# Altium schematic sheet connectors.SchDoc: Triumvi - MCU - Connectors
size Letter; Author: Ye-Sheng Kuo; Revision: 9; SheetNumber: 5; SheetTotal: 5
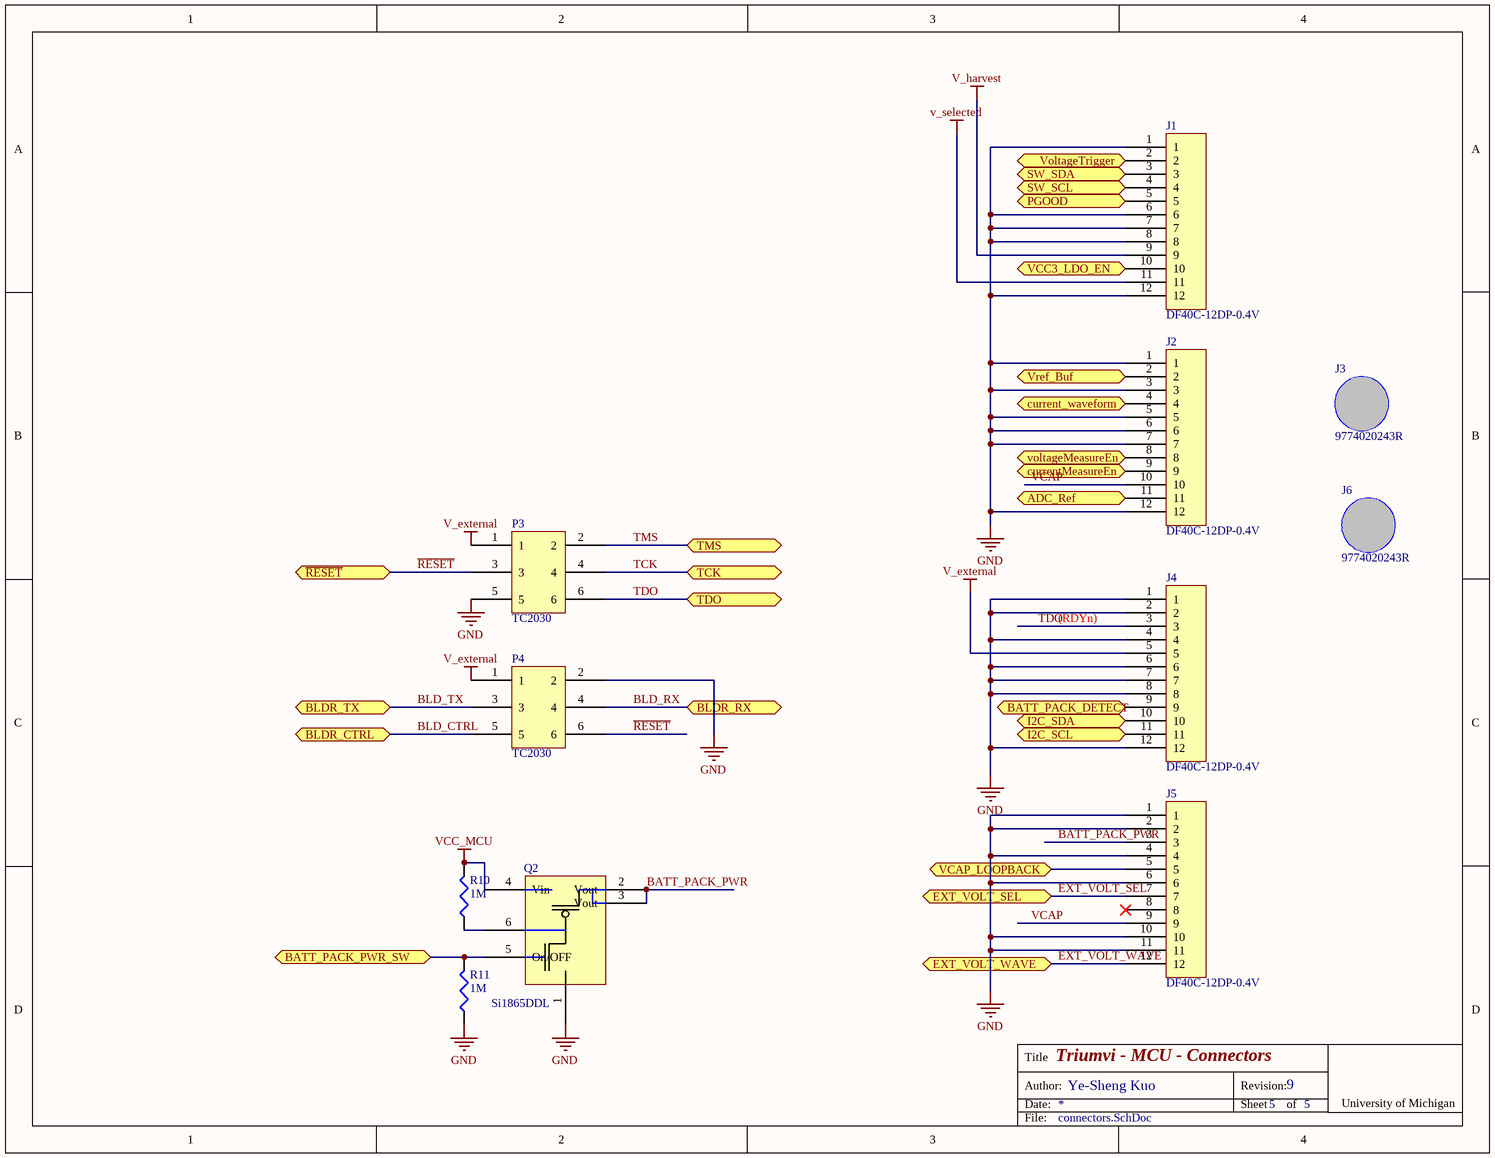
[diagram p0: connectors.SchDoc]

## Parts
J1  DF40C-12DP-0.4V  [DF40C-12DP-0.4V]
J2  DF40C-12DP-0.4V  [DF40C-12DP-0.4V]
J3  9774020243R  [9774020243R]
J4  DF40C-12DP-0.4V  [DF40C-12DP-0.4V]
J5  DF40C-12DP-0.4V  [DF40C-12DP-0.4V]
J6  9774020243R  [9774020243R]
P3  TC2030  [TC2030-IDC-NLFP]
P4  TC2030  [TC2030-IDC-NLFP]
Q2  Si1865DDL  [SC70-6]
R10  value 1M  [0402]  (hidden comment: Chip resistor)
R11  value 1M  [0402]  (hidden comment: Chip resistor)

## Ports
ADC_Ref, BATT_PACK_DETECT, BATT_PACK_PWR_SW, BLDR_CTRL, BLDR_RX, BLDR_TX, current_waveform, currentMeasureEn, EXT_VOLT_SEL, EXT_VOLT_WAVE, I2C_SCL, I2C_SDA, PGOOD, SW_SCL, SW_SDA, TCK, TDO, TMS, VCAP_LOOPBACK, VCC3_LDO_EN, voltageMeasureEn, VoltageTrigger, Vref_Buf, ~{RESET}

## Nets
GND: J1.1 J1.6 J1.7 J1.8 J1.12 J2.1 J2.3 J2.5 J2.6 J2.7 J2.12 J4.1 J4.2 J4.4 J4.6 J4.7 J4.8 J4.12 J5.1 J5.2 J5.4 J5.6 J5.10 J5.11 P3.5 P4.2 Q2.1(S1) R11.2
V_external: J4.5 P3.1 P4.1
V_harvest: J1.9
v_selected: J1.11
VCC_MCU: Q2.4(Vin) R10.1
ADC_Ref: J2.11 ; port ADC_Ref
BATT_PACK_DETECT: J4.9 ; port BATT_PACK_DETECT
BATT_PACK_PWR: J5.3 Q2.2(Vout) Q2.3(Vout)
BATT_PACK_PWR_SW: Q2.5(On/OFF) R11.1 ; port BATT_PACK_PWR_SW
BLD_CTRL: P4.5 ; port BLDR_CTRL
BLD_RX: P4.4 ; port BLDR_RX
BLD_TX: P4.3 ; port BLDR_TX
current_waveform: J2.4 ; port current_waveform
currentMeasureEn: J2.9 ; port currentMeasureEn
EXT_VOLT_SEL: J5.7 ; port EXT_VOLT_SEL
EXT_VOLT_WAVE: J5.12 ; port EXT_VOLT_WAVE
I2C_SCL: J4.11 ; port I2C_SCL
I2C_SDA: J4.10 ; port I2C_SDA
PGOOD: J1.5 ; port PGOOD
~{RESET}: P3.3 P4.6 ; port ~{RESET}
SW_SCL: J1.4 ; port SW_SCL
SW_SDA: J1.3 ; port SW_SDA
TCK: P3.4 ; port TCK
TDO: J4.3 P3.6 ; port TDO
TMS: P3.2 ; port TMS
VCAP: J2.10 J5.9
VCAP_LOOPBACK: J5.5 ; port VCAP_LOOPBACK
VCC3_LDO_EN: J1.10 ; port VCC3_LDO_EN
voltageMeasureEn: J2.8 ; port voltageMeasureEn
VoltageTrigger: J1.2 ; port VoltageTrigger
Vref_Buf: J2.2 ; port Vref_Buf
NetQ2_6: Q2.6(D1) R10.2

Not connected (* = marked no-connect by the designer): J5 8*

## Notes on the sheet
- (RDYn)
- Title
- Date:
- Author:
- Revision:
- Sheet
- of
- University of Michigan
- File:

## Library data of the parts
J1 J2 J4 J5 = DF40C-12DP-0.4V: Hirose BM20 Series, 0.4mm pitch, 12 pos, header; Supplier 1: Digi-Key; Supplier Part Number 1: H124599CT-ND
J3 J6 = 9774020243R: 2 mm stack height, m2 standoff; Supplier 1: Digi-Key; Supplier Part Number 1: 732-7073-1-ND
P3 P4 = TC2030: TC2030-MCP-NL
Q2 = Si1865DDL: Load Switch with Level-Shift; Supplier 1: Digi-Key; Supplier Part Number 1: SI1865DDL-T1-GE3CT-ND
R10 R11 = R_1M_0402: Chip resistor, 1M, 0402 package; tolerance: 1%; power: 1/16 W; Supplier 1: Digi-Key; Supplier Part Number 1: 541-1.00MLCT-ND; package: 0402